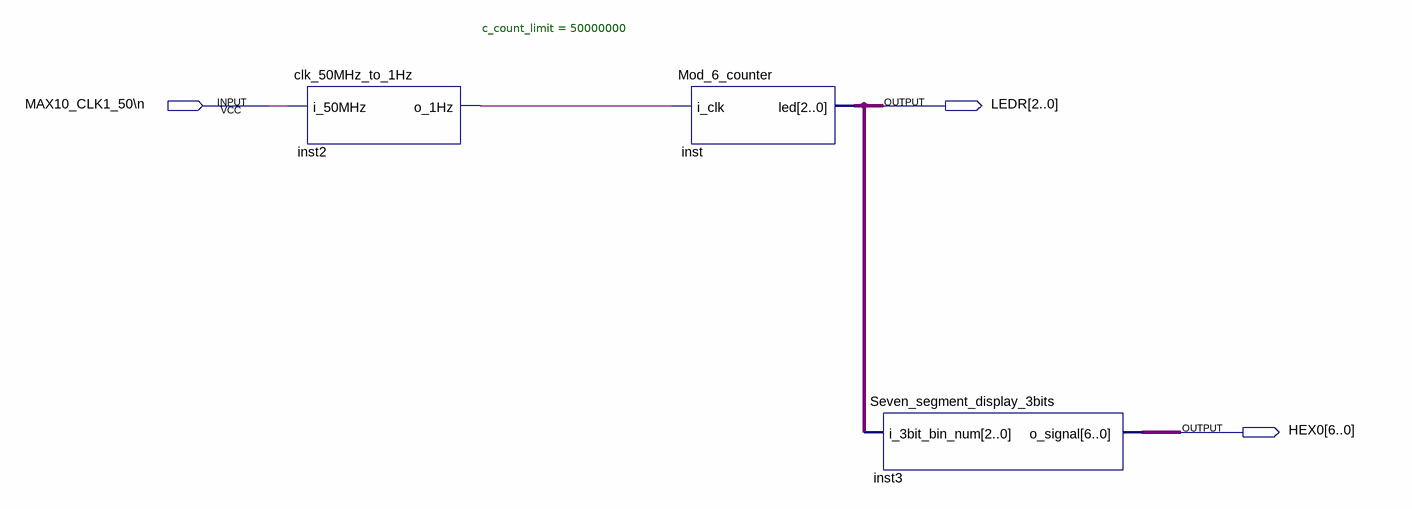
[diagram p0: schematic sheet]
// Quartus schematic Top.bdf as structural Verilog: 3 symbols, 3 pins
module Top (
  input  \MAX10_CLK1_50\n ,
  output [2:0] LEDR,
  output [6:0] HEX0
);

  wire inst2_o_1hz;

  clk_50MHz_to_1Hz #(.c_count_limit(50000000)) inst2 (.i_50MHz(\MAX10_CLK1_50\n ), .o_1Hz(inst2_o_1hz));
  Mod_6_counter inst (.i_clk(inst2_o_1hz), .led(LEDR));
  Seven_segment_display_3bits inst3 (.i_3bit_bin_num(LEDR), .o_signal(HEX0));
endmodule
